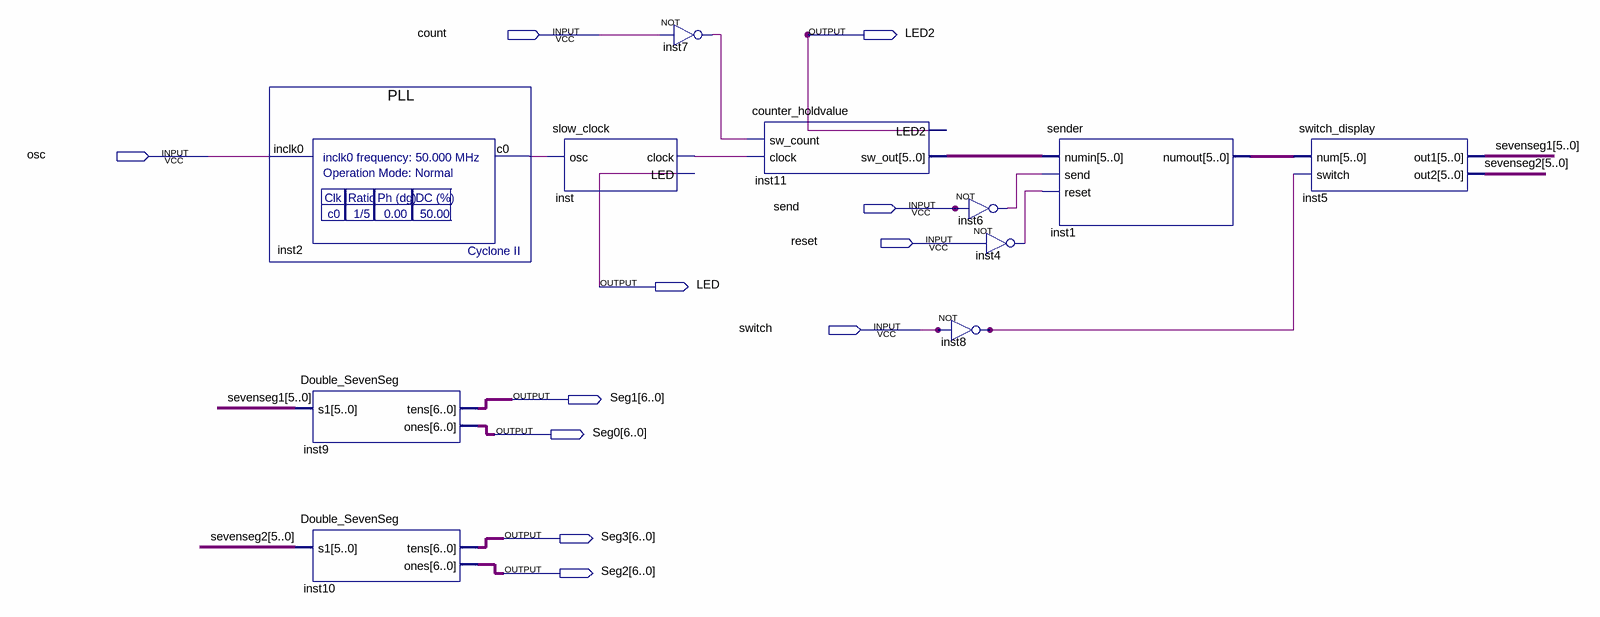
[diagram p0: schematic sheet]
// Quartus schematic 3rdExercise.bdf as structural Verilog: 11 symbols, 11 pins
module \3rdExercise  (
  input  count,
  input  osc,
  input  send,
  input  reset,
  input  switch,
  output LED2,
  output LED,
  output [6:0] Seg1,
  output [6:0] Seg0,
  output [6:0] Seg3,
  output [6:0] Seg2
);

  wire inst2_c0, inst4_out, inst6_out, inst7_out, inst8_out, inst_clock;
  wire [5:0] inst1_numout, inst11_sw_out, sevenseg1, sevenseg2;

  PLL inst2 (.inclk0(osc), .c0(inst2_c0));
  Double_SevenSeg inst9 (.s1(sevenseg1), .tens(Seg1), .ones(Seg0));
  Double_SevenSeg inst10 (.s1(sevenseg2), .tens(Seg3), .ones(Seg2));
  slow_clock inst (.osc(inst2_c0), .clock(inst_clock), .LED(LED));
  not inst7 (inst7_out, count);
  counter_holdvalue inst11 (.sw_count(inst7_out), .clock(inst_clock), .sw_out(inst11_sw_out), .LED2(LED2));
  not inst8 (inst8_out, switch);
  not inst6 (inst6_out, send);
  not inst4 (inst4_out, reset);
  sender inst1 (.numin(inst11_sw_out), .send(inst6_out), .reset(inst4_out), .numout(inst1_numout));
  switch_display inst5 (.num(inst1_numout), .switch(inst8_out), .out1(sevenseg1), .out2(sevenseg2));
endmodule
